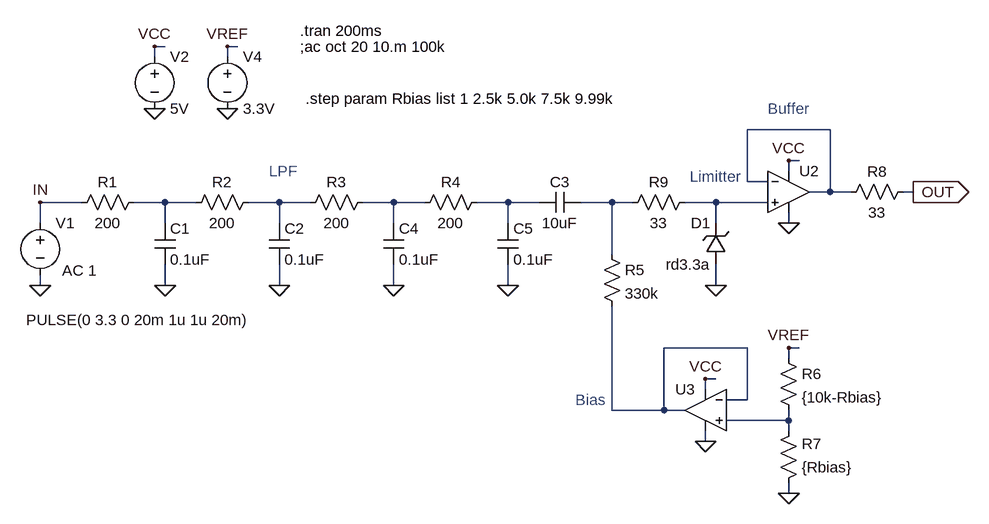
[diagram p0: schematic ArduinoLFO_Ouput_Board_Zener_Limiter.asc]
ArduinoLFO_Ouput_Board_Zener_Limiter.asc, the LTspice schematic file:
Version 4
SHEET 1 1700 680
WIRE 208 -160 192 -160
WIRE 320 -160 304 -160
WIRE 192 -144 192 -160
WIRE 304 -144 304 -160
WIRE 1232 -32 1104 -32
WIRE 1184 16 1168 16
WIRE 1168 32 1168 16
WIRE 1104 48 1104 -32
WIRE 1136 48 1104 48
WIRE 1232 64 1232 -32
WIRE 1232 64 1200 64
WIRE 1264 64 1232 64
WIRE 1360 64 1344 64
WIRE 80 80 16 80
WIRE 208 80 160 80
WIRE 256 80 208 80
WIRE 384 80 336 80
WIRE 432 80 384 80
WIRE 560 80 512 80
WIRE 608 80 560 80
WIRE 736 80 688 80
WIRE 784 80 736 80
WIRE 896 80 848 80
WIRE 928 80 896 80
WIRE 1056 80 1008 80
WIRE 1136 80 1056 80
WIRE 16 112 16 80
WIRE 208 112 208 80
WIRE 384 112 384 80
WIRE 560 112 560 80
WIRE 736 112 736 80
WIRE 1056 112 1056 80
WIRE 1168 112 1168 96
WIRE 896 160 896 80
WIRE 16 208 16 192
WIRE 208 208 208 176
WIRE 384 208 384 176
WIRE 560 208 560 176
WIRE 736 208 736 176
WIRE 1056 208 1056 176
WIRE 1104 304 976 304
WIRE 1184 304 1168 304
WIRE 1168 320 1168 304
WIRE 1056 352 1040 352
WIRE 1040 368 1040 352
WIRE 1104 384 1104 304
WIRE 1104 384 1072 384
WIRE 896 400 896 240
WIRE 976 400 976 304
WIRE 976 400 896 400
WIRE 1008 400 976 400
WIRE 1168 416 1168 400
WIRE 1168 416 1072 416
WIRE 1168 432 1168 416
WIRE 1040 448 1040 432
WIRE 1168 528 1168 512
FLAG 16 208 0
FLAG 16 80 IN
FLAG 208 208 0
FLAG 1360 64 OUT
IOPIN 1360 64 Out
FLAG 384 208 0
FLAG 192 -64 0
FLAG 192 -160 VCC
FLAG 1168 16 VCC
FLAG 1168 112 0
FLAG 304 -64 0
FLAG 304 -160 VREF
FLAG 1040 352 VCC
FLAG 1040 448 0
FLAG 1168 528 0
FLAG 1168 304 VREF
FLAG 1056 208 0
FLAG 560 208 0
FLAG 736 208 0
SYMBOL voltage 16 96 R0
WINDOW 3 -22 165 Left 2
WINDOW 123 34 89 Left 2
WINDOW 39 0 0 Left 2
SYMATTR Value PULSE(0 3.3 0 20m 1u 1u 20m)
SYMATTR Value2 AC 1
SYMATTR InstName V1
SYMBOL cap 192 112 R0
SYMATTR InstName C1
SYMATTR Value 0.1uF
SYMBOL res 176 64 R90
WINDOW 0 0 56 VBottom 2
WINDOW 3 32 56 VTop 2
SYMATTR InstName R1
SYMATTR Value 200
SYMBOL cap 368 112 R0
SYMATTR InstName C2
SYMATTR Value 0.1uF
SYMBOL res 352 64 R90
WINDOW 0 0 56 VBottom 2
WINDOW 3 32 56 VTop 2
SYMATTR InstName R2
SYMATTR Value 200
SYMBOL voltage 192 -160 R0
SYMATTR InstName V2
SYMATTR Value 5V
SYMBOL res 880 144 R0
SYMATTR InstName R5
SYMATTR Value 330k
SYMBOL cap 848 64 R90
WINDOW 0 0 32 VBottom 2
WINDOW 3 32 32 VTop 2
SYMATTR InstName C3
SYMATTR Value 10uF
SYMBOL Opamps\\UniversalOpamp2 1168 64 R0
SYMATTR InstName U2
SYMBOL voltage 304 -160 R0
SYMATTR InstName V4
SYMATTR Value 3.3V
SYMBOL Opamps\\UniversalOpamp2 1040 400 M0
SYMATTR InstName U3
SYMBOL res 1152 304 R0
SYMATTR InstName R6
SYMATTR Value {10k-Rbias}
SYMBOL res 1152 528 M180
WINDOW 0 36 76 Left 2
WINDOW 3 36 40 Left 2
SYMATTR InstName R7
SYMATTR Value {Rbias}
SYMBOL res 1360 48 R90
WINDOW 0 0 56 VBottom 2
WINDOW 3 32 56 VTop 2
SYMATTR InstName R8
SYMATTR Value 33
SYMBOL cap 544 112 R0
SYMATTR InstName C4
SYMATTR Value 0.1uF
SYMBOL cap 720 112 R0
SYMATTR InstName C5
SYMATTR Value 0.1uF
SYMBOL res 704 64 R90
WINDOW 0 0 56 VBottom 2
WINDOW 3 32 56 VTop 2
SYMATTR InstName R4
SYMATTR Value 200
SYMBOL res 528 64 R90
WINDOW 0 0 56 VBottom 2
WINDOW 3 32 56 VTop 2
SYMATTR InstName R3
SYMATTR Value 200
SYMBOL res 1024 64 R90
WINDOW 0 0 56 VBottom 2
WINDOW 3 32 56 VTop 2
SYMATTR InstName R9
SYMATTR Value 33
SYMBOL zener 1072 176 R180
WINDOW 0 24 64 Left 2
WINDOW 3 24 0 Left 2
SYMATTR InstName D1
SYMATTR Value rd3.3a
TEXT 416 -184 Left 2 !.tran 200ms
TEXT 416 -160 Left 2 !;ac oct 20 10.m 100k
TEXT 424 -80 Left 2 !.step param Rbias list 1 2.5k 5.0k 7.5k 9.99k
TEXT 368 32 Left 2 ;LPF
TEXT 1016 40 Left 2 ;Limitter
TEXT 840 384 Left 2 ;Bias
TEXT 1136 -64 Left 2 ;Buffer

The netlist it stands for:
* ArduinoLFO_Ouput_Board_Zener_Limiter.asc
V1 IN 0 PULSE(0 3.3 0 20m 1u 1u 20m) AC 1
C1 N002 0 0.1uF
R1 N002 IN 200
C2 N003 0 0.1uF
R2 N003 N002 200
V2 VCC 0 5V
R5 N006 N008 330k
C3 N006 N005 10uF
XU2 N007 N001 VCC 0 N001 level.2 Avol=1Meg GBW=10Meg Slew=10Meg ilimit=25m rail=0 Vos=0 phimargin=45 en=0 enk=0 in=0 ink=0 Rin=500Meg  ; pins IN+ IN- V+ V- OUT
V4 VREF 0 3.3V
XU3 N009 N008 VCC 0 N008 level.2 Avol=1Meg GBW=10Meg Slew=10Meg ilimit=25m rail=0 Vos=0 phimargin=45 en=0 enk=0 in=0 ink=0 Rin=500Meg  ; pins IN+ IN- V+ V- OUT
R6 VREF N009 {10k-Rbias}
R7 0 N009 {Rbias}
R8 OUT N001 33
C4 N004 0 0.1uF
C5 N005 0 0.1uF
R4 N005 N004 200
R3 N004 N003 200
R9 N007 N006 33
D1 0 N007 rd3.3a
.model D D
.lib standard.dio
.tran 200ms
;ac oct 20 10.m 100k
.step param Rbias list 1 2.5k 5.0k 7.5k 9.99k
* LPF
* Limitter
* Bias
* Buffer
.lib UniversalOpamps2.sub
.backanno
.end